# EAGLE schematic CMoy-Pro-V_0_0_1A (EAGLE 6.4)
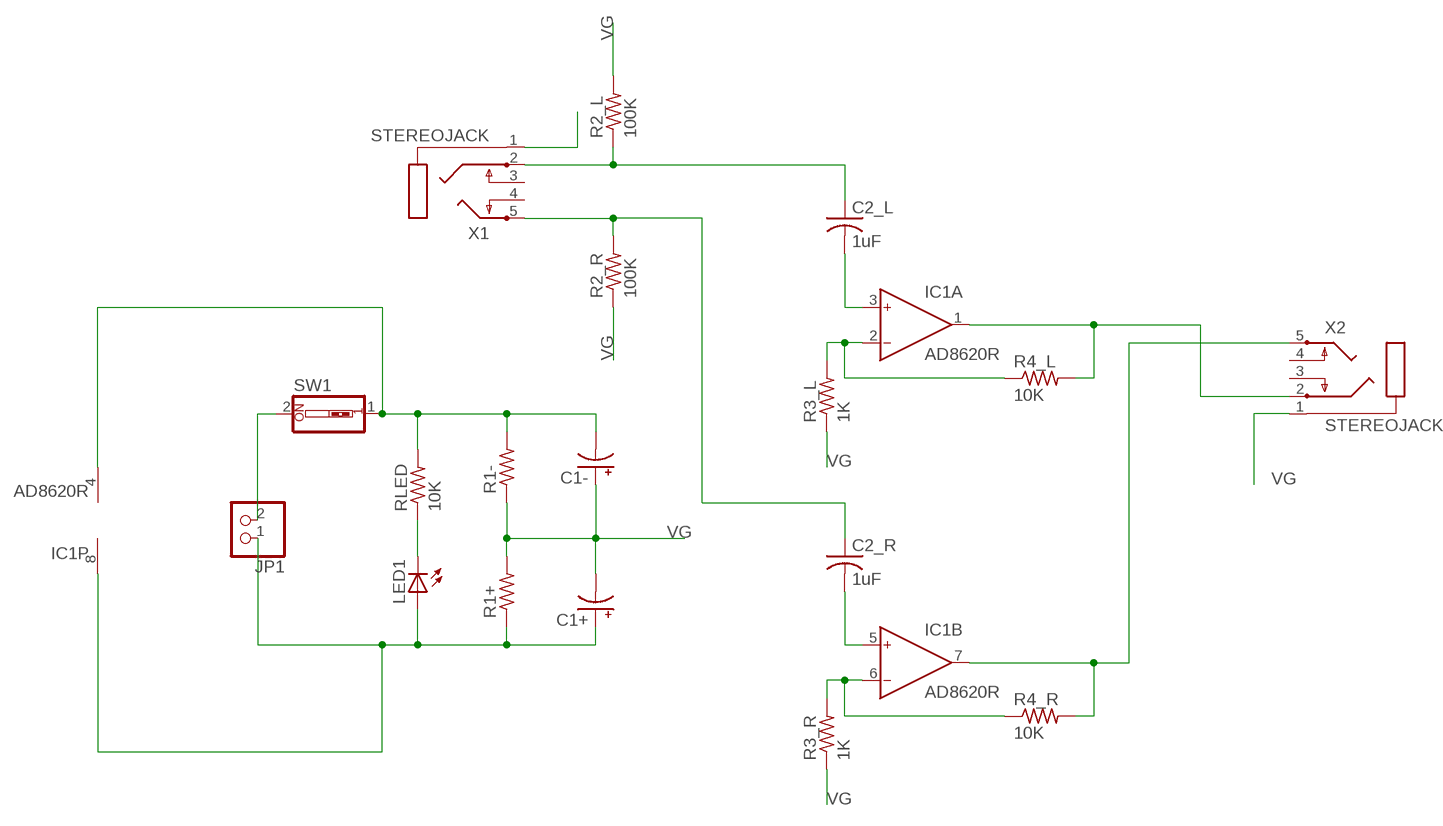
[diagram p0: schematic, sheet 1]

## Parts
C1+  CPOL-USE2.5-6  [E2,5-6]
C1-  CPOL-USE2.5-6  [E2,5-6]
C2_L  1uF  C-US102-043X133  [C102-043X133]
C2_R  1uF  C-US102-043X133  [C102-043X133]
IC1  AD8620R  [SO8]
JP1  PINHD-1X2  [1X02]
LED1  LED3MM  [LED3MM]
R1+  R-US_0207/7  [0207/7]
R1-  R-US_0207/7  [0207/7]
R2_L  100K  R-US_0207/7  [0207/7]
R2_R  100K  R-US_0207/7  [0207/7]
R3_L  1K  R-US_0207/7  [0207/7]
R3_R  1K  R-US_0207/7  [0207/7]
R4_L  10K  R-US_0207/7  [0207/7]
R4_R  10K  R-US_0207/7  [0207/7]
RLED  10K  R-US_0207/7  [0207/7]
SW1  SW_DIP-1  [EDG-01]
X1  STEREOJACK  [STX3100]
X2  STEREOJACK  [STX3100]

## Nets
IN_L: C2_L.1 R2_L.1 X1.2
IN_R: C2_R.1 R2_R.2 X1.5
N$1: C2_L.2 IC1.3(A:IN+)
N$2: C2_R.2 IC1.5(B:IN+)
N$3: LED1.K(C) RLED.1
N$5: IC1.2(A:IN-) R3_L.2 R4_L.1
N$6: IC1.6(B:IN-) R3_R.2 R4_R.1
OUT_L: IC1.1(A:OUT) R4_L.2 X2.2
OUT_R: IC1.7(B:OUT) R4_R.2 X2.5
V+: C1+.+ IC1.8(P:V+) JP1.1 LED1.A R1+.1
V-: JP1.2 SW1.2
V-_ON: C1-.- IC1.4(P:V-) R1-.2 RLED.2 SW1.1
VG: C1+.- C1-.+ R1+.2 R1-.1 R2_L.2 R2_R.1 R3_L.1 R3_R.1 X1.1 X2.1
Unconnected: X1.3 X1.4 X2.3 X2.4

## Library data of the parts
C1+ C1- = rcl:CPOL-US: POLARIZED CAPACITOR, American symbol
C2_L C2_R = rcl:C-US: CAPACITOR, American symbol
IC1 = analog-devices:AD8620: Precision, Very Low Noise, Low Input Bias Current, Wide Bandwidth JFET Operational Amplifiers Source: http://www.analog.com/static/imported-files/data_sheets/AD8610_8620.pdf; MF: ALTERA CORPORATION; MPN: AD8620ARZ; OC_FARNELL: 9994386; OC_NEWARK: 59K6972
JP1 = pinhead:PINHD-1X2: PIN HEADER
LED1 = adafruit:LED: LED OSRAM: - CHIPLED LG R971, LG N971, LY N971, LG Q971, LY Q971, LO R971, LY R971 LH N974, LH R974 LS Q976, LO Q976, LY Q976 LO Q996 - Hyper CHIPLED LW Q18S LB Q993, LB Q99A, LB R99A - SideLED LS A670, LO A670, LY A670, LG A670, LP A670 LB A673, LV A673, LT A673, LW A673 LH A674 LY A675 LS A676, LA A676, LO A676, LY A676, LW A676 LS A679, LY A679, LG A679 - Hyper Micro SIDELED® LS Y876, LA Y876, LO Y876, LY Y876 LT Y87S - SmartLED LW L88C, LW L88S LB L89C, LB L89S, LG L890 LS L89K, LO L89K, LY L89K LS L896, LA L896, LO L896, LY L896 - TOPLED LS T670, LO T670, LY T670, LG T670, LP T670 LSG T670, LSP T670, LSY T670, LOP T670, LYG T670 LG T671, LOG T671, LSG T671 LB T673, LV T673, LT T673, LW T673 LH T674 LS T676, LA T676, LO T676, LY T676, LB T676, LH T676, LSB T676, LW T676 LB T67C, LV T67C, LT T67C, LS T67K, LO T67K, LY T67K, LW E67C LS E67B, LA E67B, LO E67B, LY E67B, LB E67C, LV E67C, LT E67C LW T67C LS T679, LY T679, LG T679 LS T770, LO T770, LY T770, LG T770, LP T770 LB T773, LV T773, LT T773, LW T773 LH T774 LS E675, LA E675, LY E675, LS T675 LS T776, LA T776, LO T776, LY T776, LB T776 LHGB T686 LT T68C, LB T68C - Hyper Mini TOPLED® LB M676 - Mini TOPLED Santana® LG M470 LS M47K, LO M47K, LY M47K Source: http://www.osram.convergy.de/
R1+ R1- R2_L R2_R R3_L R3_R R4_L R4_R RLED = rcl:R-US_: RESISTOR, American symbol
SW1 = special:SW_DIP-1: DIP SWITCH
X1 X2 = adafruit:STEREOJACK: MIC/HEADPHONE JACK Stereo jack with two switches. Kycon STX3100, CUI SJ1-3555NG and/or 4UCon 05544